# Altium schematic sheet Main.SchDoc
size A3
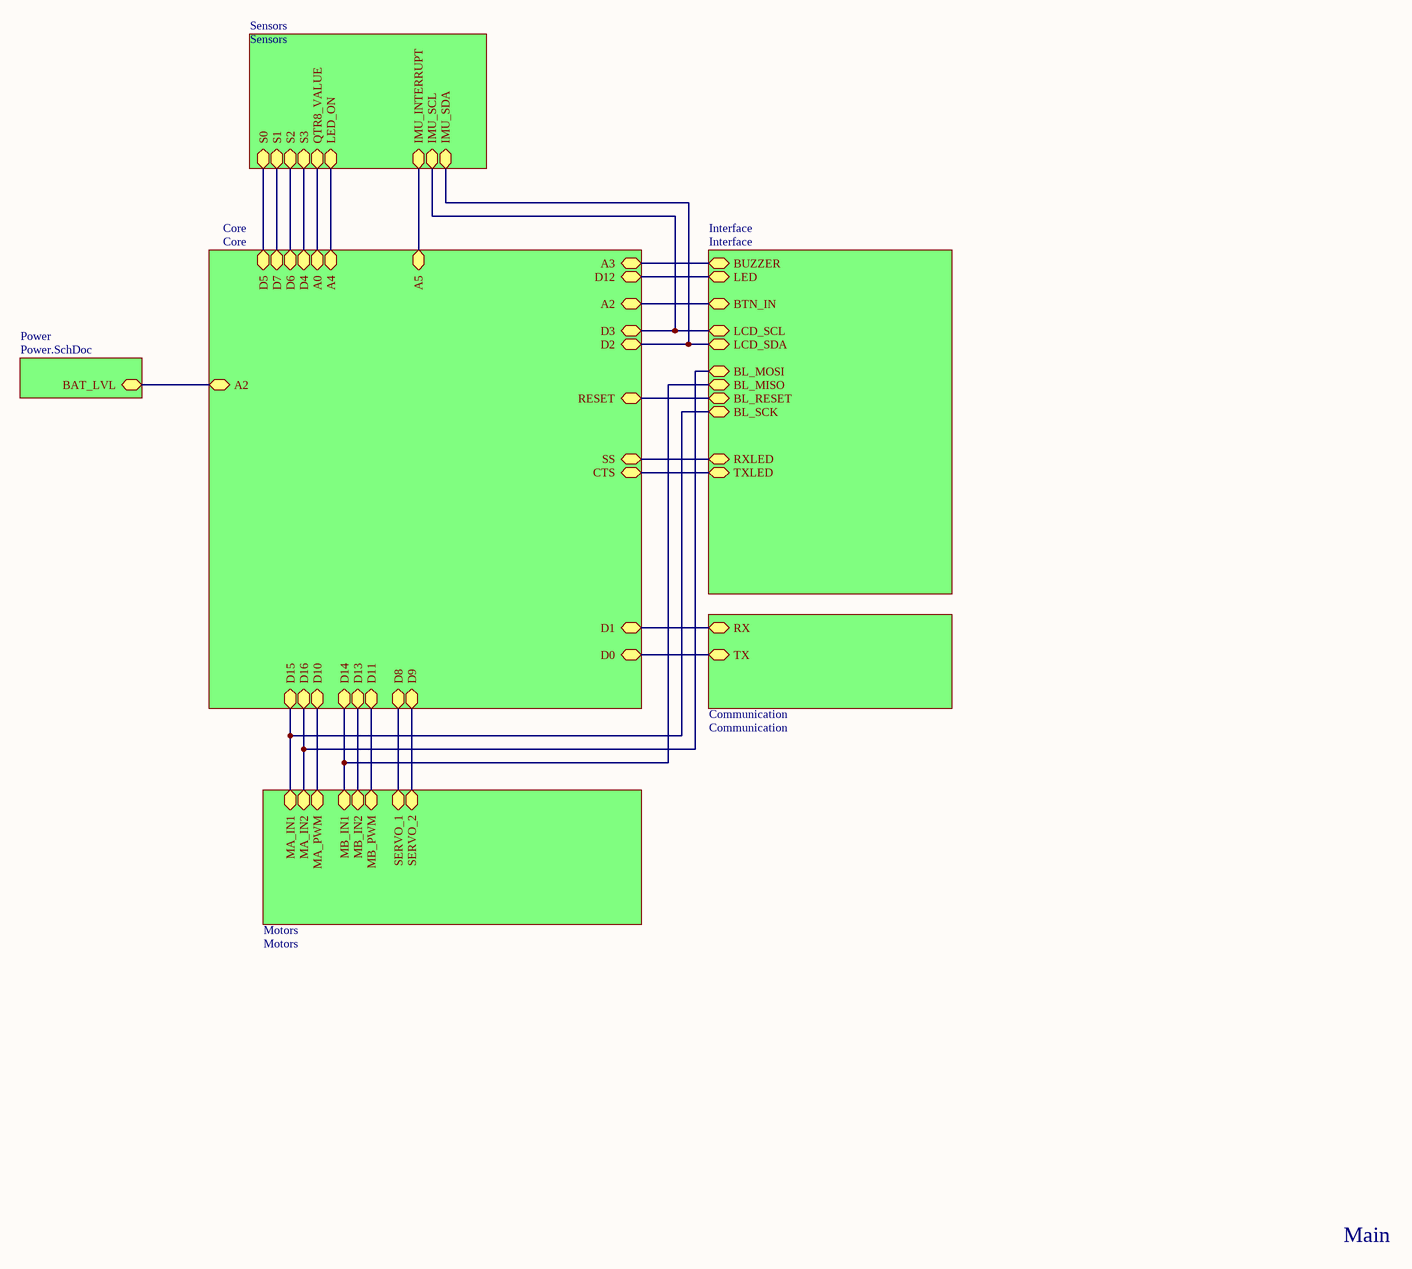
[diagram p0: Main.SchDoc]

## Sub-sheets
Communication = Communication: RX (bidir), TX (bidir)
Core = Core: D5 (bidir), D7 (bidir), D6 (bidir), D4 (bidir), A0 (bidir), A3 (bidir), D12 (bidir), A2 (bidir), D1 (bidir), D0 (bidir), D13 (bidir), D14 (bidir), D10 (bidir), D16 (bidir), D15 (bidir), D11 (bidir), D8 (bidir), A4, A2, D9, RESET, SS (bidir), CTS (bidir), D3, D2, A5
Interface = Interface: BUZZER (bidir), LED (bidir), BTN_IN (bidir), LCD_SCL (bidir), LCD_SDA (bidir), BL_MOSI, BL_MISO, BL_RESET, BL_SCK, RXLED (bidir), TXLED (bidir)
Motors = Motors: MA_IN1 (bidir), MA_IN2 (bidir), MA_PWM (bidir), MB_IN1 (bidir), MB_IN2 (bidir), MB_PWM (bidir), SERVO_1 (bidir), SERVO_2
Power = Power.SchDoc: BAT_LVL
Sensors = Sensors: S0 (bidir), S1 (bidir), S2 (bidir), S3 (bidir), QTR8_VALUE (bidir), LED_ON, IMU_INTERRUPT (bidir), IMU_SCL (bidir), IMU_SDA (bidir)

## Nets
(unnamed): sheet Core/D5, sheet Sensors/S0
(unnamed): sheet Core/D7, sheet Sensors/S1
(unnamed): sheet Core/D6, sheet Sensors/S2
(unnamed): sheet Core/D4, sheet Sensors/S3
(unnamed): sheet Core/A0, sheet Sensors/QTR8_VALUE
(unnamed): sheet Core/A3, sheet Interface/BUZZER
(unnamed): sheet Core/D12, sheet Interface/LED
(unnamed): sheet Core/A2, sheet Interface/BTN_IN
(unnamed): sheet Core/D1, sheet Communication/RX
(unnamed): sheet Core/D0, sheet Communication/TX
(unnamed): sheet Core/D13, sheet Motors/MB_IN2
(unnamed): sheet Core/D14, sheet Interface/BL_MISO, sheet Motors/MB_IN1
(unnamed): sheet Core/D10, sheet Motors/MA_PWM
(unnamed): sheet Core/D16, sheet Interface/BL_MOSI, sheet Motors/MA_IN2
(unnamed): sheet Core/D15, sheet Interface/BL_SCK, sheet Motors/MA_IN1
(unnamed): sheet Core/D11, sheet Motors/MB_PWM
(unnamed): sheet Core/D8, sheet Motors/SERVO_1
(unnamed): sheet Core/A4, sheet Sensors/LED_ON
(unnamed): sheet Core/A2, sheet Power/BAT_LVL
(unnamed): sheet Core/D9, sheet Motors/SERVO_2
(unnamed): sheet Core/RESET, sheet Interface/BL_RESET
(unnamed): sheet Core/SS, sheet Interface/RXLED
(unnamed): sheet Core/CTS, sheet Interface/TXLED
(unnamed): sheet Core/D3, sheet Sensors/IMU_SCL, sheet Interface/LCD_SCL
(unnamed): sheet Core/D2, sheet Sensors/IMU_SDA, sheet Interface/LCD_SDA
(unnamed): sheet Core/A5, sheet Sensors/IMU_INTERRUPT

## Notes on the sheet
- Main